# EAGLE design 2layer_shunt_test_2x (EAGLE 9.2.2)
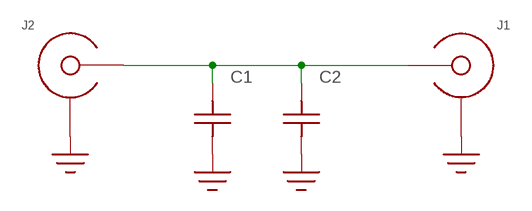
[diagram p0: schematic, sheet 1]

## Parts
C1  C0603  [C0603]
C2  C  [C0402]
J1  SMA_END_LAUNCH2L  [SMA_EDGE_LAUNCH_2L]
J2  SMA_END_LAUNCH2L  [SMA_EDGE_LAUNCH_2L]

## Nets
GND: C1.P$1 C2.1 J1.BOTTOM_GND(SHIELD) J1.GND@1(SHIELD) J1.GND@2(SHIELD) J1.GND@3(SHIELD) J1.GND@4(SHIELD) J1.GND@5(SHIELD) J1.GND@6(SHIELD) J1.GND@7(SHIELD) J1.GND@8(SHIELD) J1.GND@11(SHIELD) J1.GND@12(SHIELD) J1.GND@14(SHIELD) J1.GND@15(SHIELD) J1.GND@16(SHIELD) J1.GND@17(SHIELD) J1.GND_PAD1(SHIELD) J1.GND_PAD2(SHIELD) J2.BOTTOM_GND(SHIELD) J2.GND@1(SHIELD) J2.GND@2(SHIELD) J2.GND@3(SHIELD) J2.GND@4(SHIELD) J2.GND@5(SHIELD) J2.GND@6(SHIELD) J2.GND@7(SHIELD) J2.GND@8(SHIELD) J2.GND@11(SHIELD) J2.GND@12(SHIELD) J2.GND@14(SHIELD) J2.GND@15(SHIELD) J2.GND@16(SHIELD) J2.GND@17(SHIELD) J2.GND_PAD1(SHIELD) J2.GND_PAD2(SHIELD)
N$1 [32/6]: C1.P$2 C2.2 J1.CENTER@1(CENTER) J2.CENTER@1(CENTER)

## Library data of the parts
C1 C2 = yapo:C
J1 J2 = yapo:SMA_END_LAUNCH

## Net classes
1 32/6: width 0.813 mm, clearance 0.152 mm

## Board
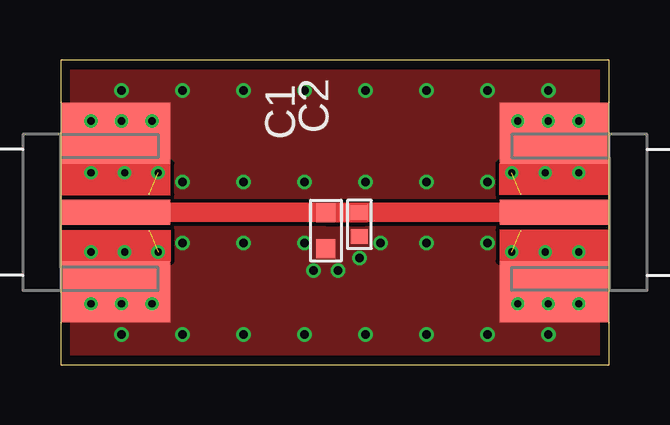
[diagram p1: board, top side]
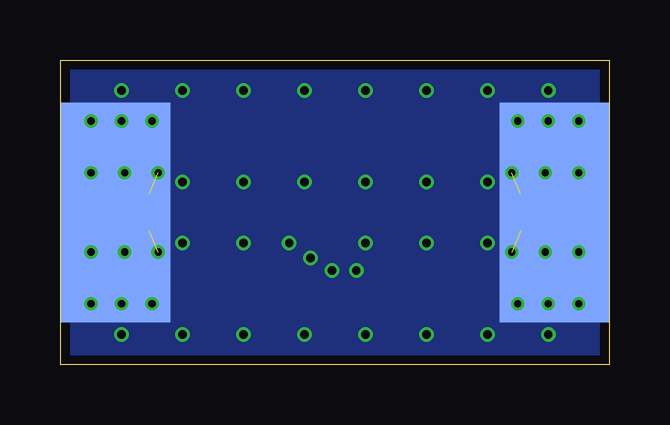
[diagram p2: board, bottom side, seen from below]

Size 22.86 x 12.7 mm. Coordinates in mm from the lower left corner, seen from the top.
Outline: 0,0 22.86,0 22.86,12.7 0,12.7 0,0
Copper layers (1*16): Top 0.035559375mm / dielectric 1.6mm / Bottom 0.035559375mm
Design rules "oshpark-2layer *": minimum track width 6mil, minimum drill 10mil, track to track 6mil, track to pad 6mil, pad to pad 6mil, via to via 6mil, smd to smd 6mil, copper to edge 15mil, drill to drill 6mil, minimum pad ring 5mil, minimum via ring 5mil, stop-mask expansion 2.5mil, vias tented up to drill 20mil, thermal gap 10mil

### Footprints (pad centres in the part's own frame; a part is rotated, then mirrored left to right if it is on the bottom)
C0603 = smd 0.8 x 0.8: P$1 -0.75,0; P$2 0.75,0
C0402 = smd 0.6 x 0.7: 1 -0.5,0; 2 0.5,0
SMA_EDGE_LAUNCH_2L = smd 4.572 x 9.144 bottom: BOTTOM_GND 2.286,0 | smd 4.572 x 1.041: CENTER@1 2.286,0 | drill 0.3: GND@1 1.27,3.81; GND@2 3.81,3.81; GND@3 1.27,1.651; GND@4 4.064,1.651; GND@5 1.27,-1.651; GND@6 4.064,-1.651; GND@7 1.27,-3.81; GND@8 3.81,-3.81; GND@14 2.54,3.81; GND@15 2.54,-3.81; GND@16 2.667,-1.651; GND@17 2.667,1.651 | smd 0.051 x 0.051: GND@11 3.683,0.762; GND@12 3.683,-0.762 | smd 4.572 x 2.54: GND_PAD1 2.286,3.302; GND_PAD2 2.286,-3.302

### Placement (x,y rotation side)
C1  11.05,5.59 90 top
C2  12.45,5.85 90 top
J1  0,6.35 0 top
J2  22.86,6.35 180 top

### Tracks (layer width: path | path; a pad name or v marks a point on that pad's centre or on a via)
GND  (via drill 0.35)  (4 unrouted)
  other vias: 10.16,7.62 12.45,4.45 10.16,5.08 10.54,3.94 11.56,3.94 13.34,5.08 7.62,7.62 7.62,5.08 5.08,7.62 5.08,5.08 12.7,7.62 15.24,7.62 15.24,5.08 17.78,5.08 17.78,7.62 5.08,11.43 7.62,11.43 10.16,11.43 12.7,11.43 15.24,11.43 17.78,11.43 20.32,11.43 2.54,11.43 2.54,1.27 5.08,1.27 7.62,1.27 10.16,1.27 12.7,1.27 15.24,1.27 17.78,1.27 20.32,1.27
  pour Top (no thermals): 0,0 22.86,0 22.86,12.7 0,12.7
  pour Bottom (no thermals): 0,0 22.86,0 22.86,12.7 0,12.7
N$1
  Top 0.813: 2.29,6.34 J1.CENTER@1 C1.P$2 | C1.P$2 C2.2 12.7,6.35 | 12.7,6.35 J2.CENTER@1 | C1.P$2 12.69,6.34 12.7,6.35